# Altium schematic sheet replacement pcb shematic.SchDoc
size A; SheetNumber: 1; SheetTotal: 1
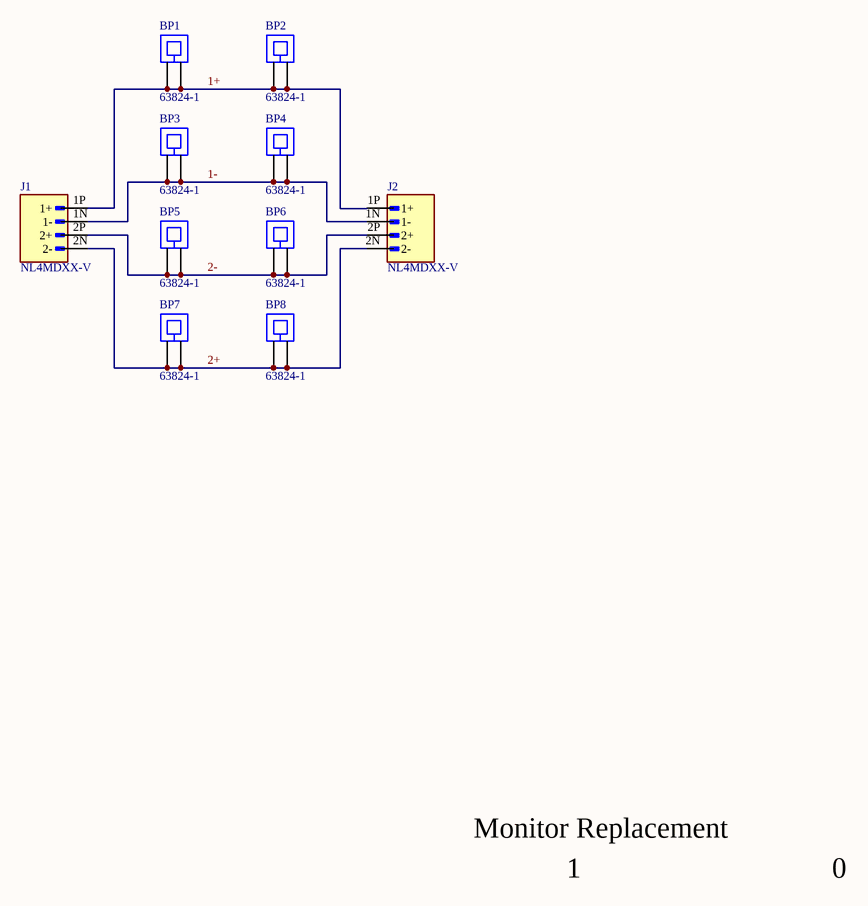
[diagram p0: replacement pcb shematic.SchDoc]

## Parts
BP1  63824-1  [TECO-63824-1_V]
BP2  63824-1  [TECO-63824-1_V]
BP3  63824-1  [TECO-63824-1_V]
BP4  63824-1  [TECO-63824-1_V]
BP5  63824-1  [TECO-63824-1_V]
BP6  63824-1  [TECO-63824-1_V]
BP7  63824-1  [TECO-63824-1_V]
BP8  63824-1  [TECO-63824-1_V]
J1  NL4MDXX-V  [NEUTRIK_NL4MDXX-V]
J2  NL4MDXX-V  [NEUTRIK_NL4MDXX-V]

## Nets
1+: BP1.1 BP1.2 BP2.1 BP2.2 J1.1P(1+) J2.1P(1+)
1-: BP3.1 BP3.2 BP4.1 BP4.2 J1.1N(1-) J2.1N(1-)
2+: BP7.1 BP7.2 BP8.1 BP8.2 J1.2N(2-) J2.2N(2-)
2-: BP5.1 BP5.2 BP6.1 BP6.2 J1.2P(2+) J2.2P(2+)

## Notes on the sheet
- Monitor Replacement
- 1
- 0

## Library data of the parts
BP1-BP8 = CMP-1684-00002-4: Printed Circuit Board Terminal and Disconnect, 2-Pin THD, RoHS, Tape and Reel; Manufacturer: TE Connectivity; Colour: Silver; Contact Material: Brass; ComponentLink2URL: http://www.te.com/commerce/DocumentDelivery/DDEController?Action=showdoc&DocId=Customer+Drawing%7F63824%7FR%7Fpdf%7FEnglish%7FENG_CD_63824_R_baseFilename.pdf%7F63824-1; ComponentLink1URL: http://www.te.com/; Mounting Technology: Through Hole; Length: 13.63 mm; RoHSCompliant: True; ComponentLink1Description: Manufacturer URL; PackageReference: 63824-1; PackageDescription: 2-Pin Through Hole Device, Body 7.92 x 3.08 mm, Pitch 5.08 mm; Package Quantity: 10000; REACH SVHC: Unknown; ComponentLink2Description: Datasheet; DatasheetVersion: Rev. R, 06/2013; Contact Plating: Tin; Packaging: Tape and Reel
J1 J2 = NL4MDXX-V: LOUDSPEAKER, PLUG, 4POS, PA6.6, PCB ROHS COMPLIANT: YES; MF: NEUTRIK; SnapEDA_Link: https://www.snapeda.com/parts/NL4MDXX-V/Neutrik/view-part/?ref=snap; Package: None; Value: *; MP: NL4MDXX-V; Check_prices: https://www.snapeda.com/parts/NL4MDXX-V/Neutrik/view-part/?ref=eda